# EAGLE board zx80 SD_12 (smd) build006.6 (STM32) (EAGLE 9.6.2), part 1 of 2
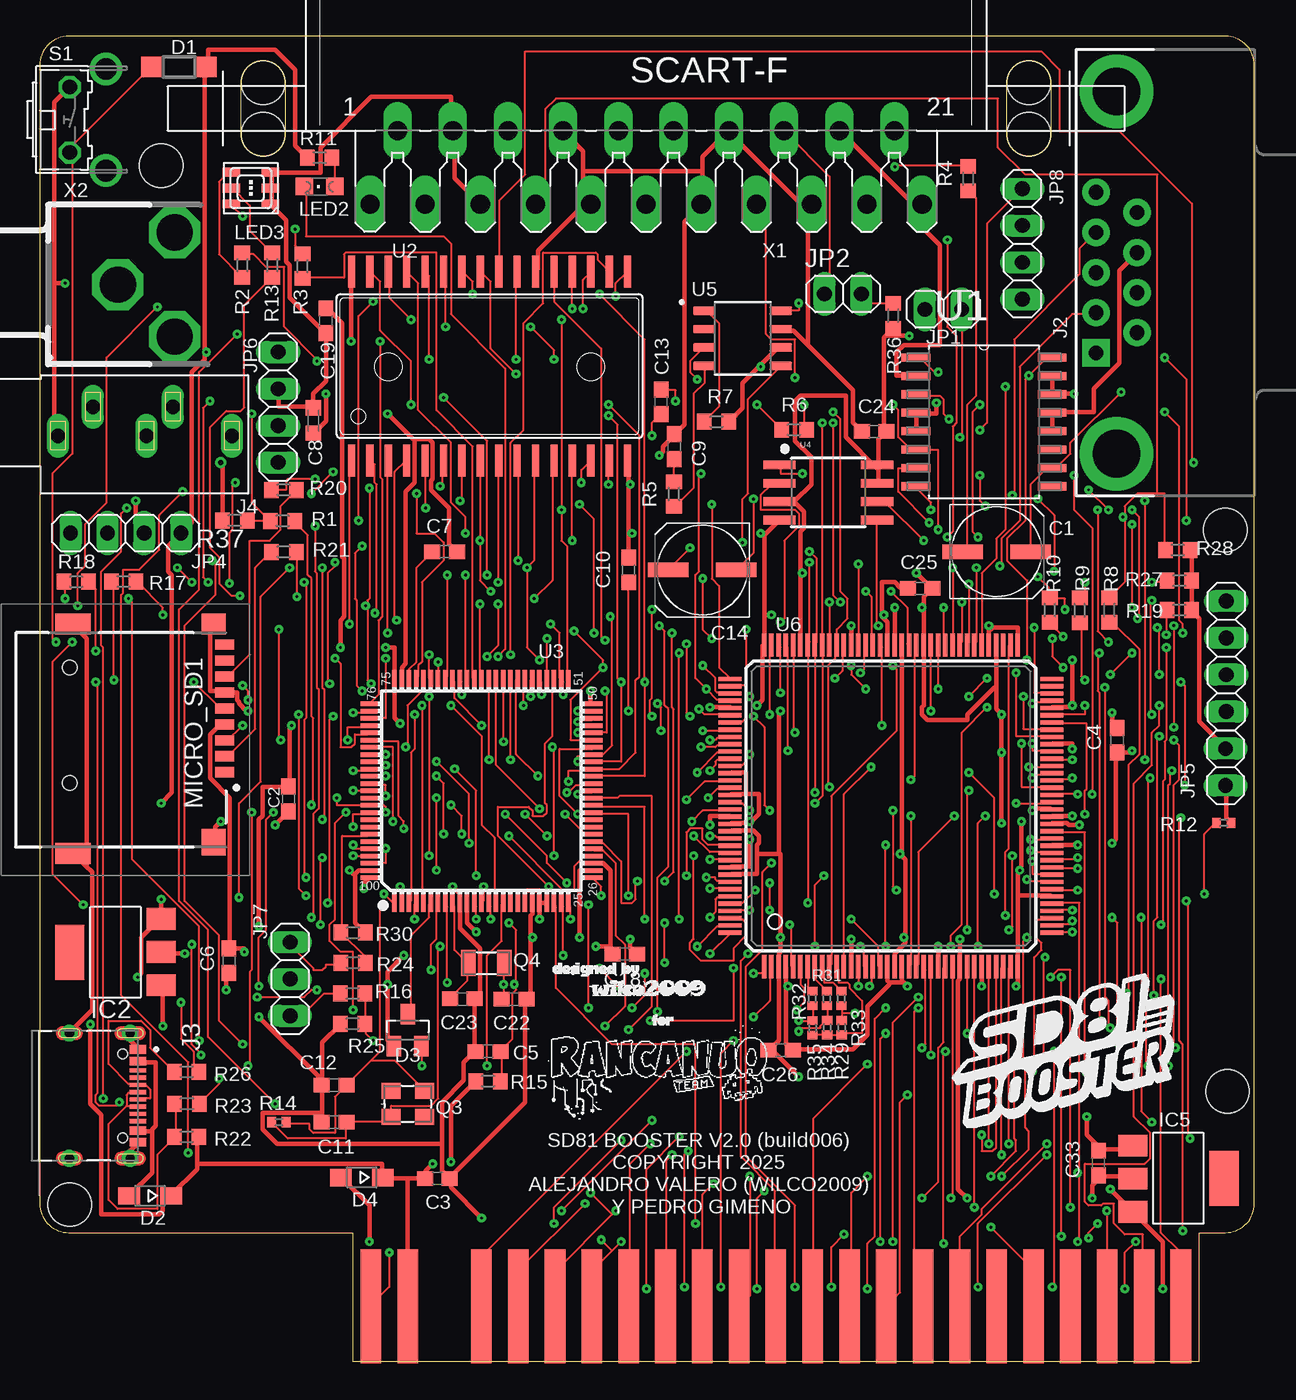
[diagram p3: board, top side]
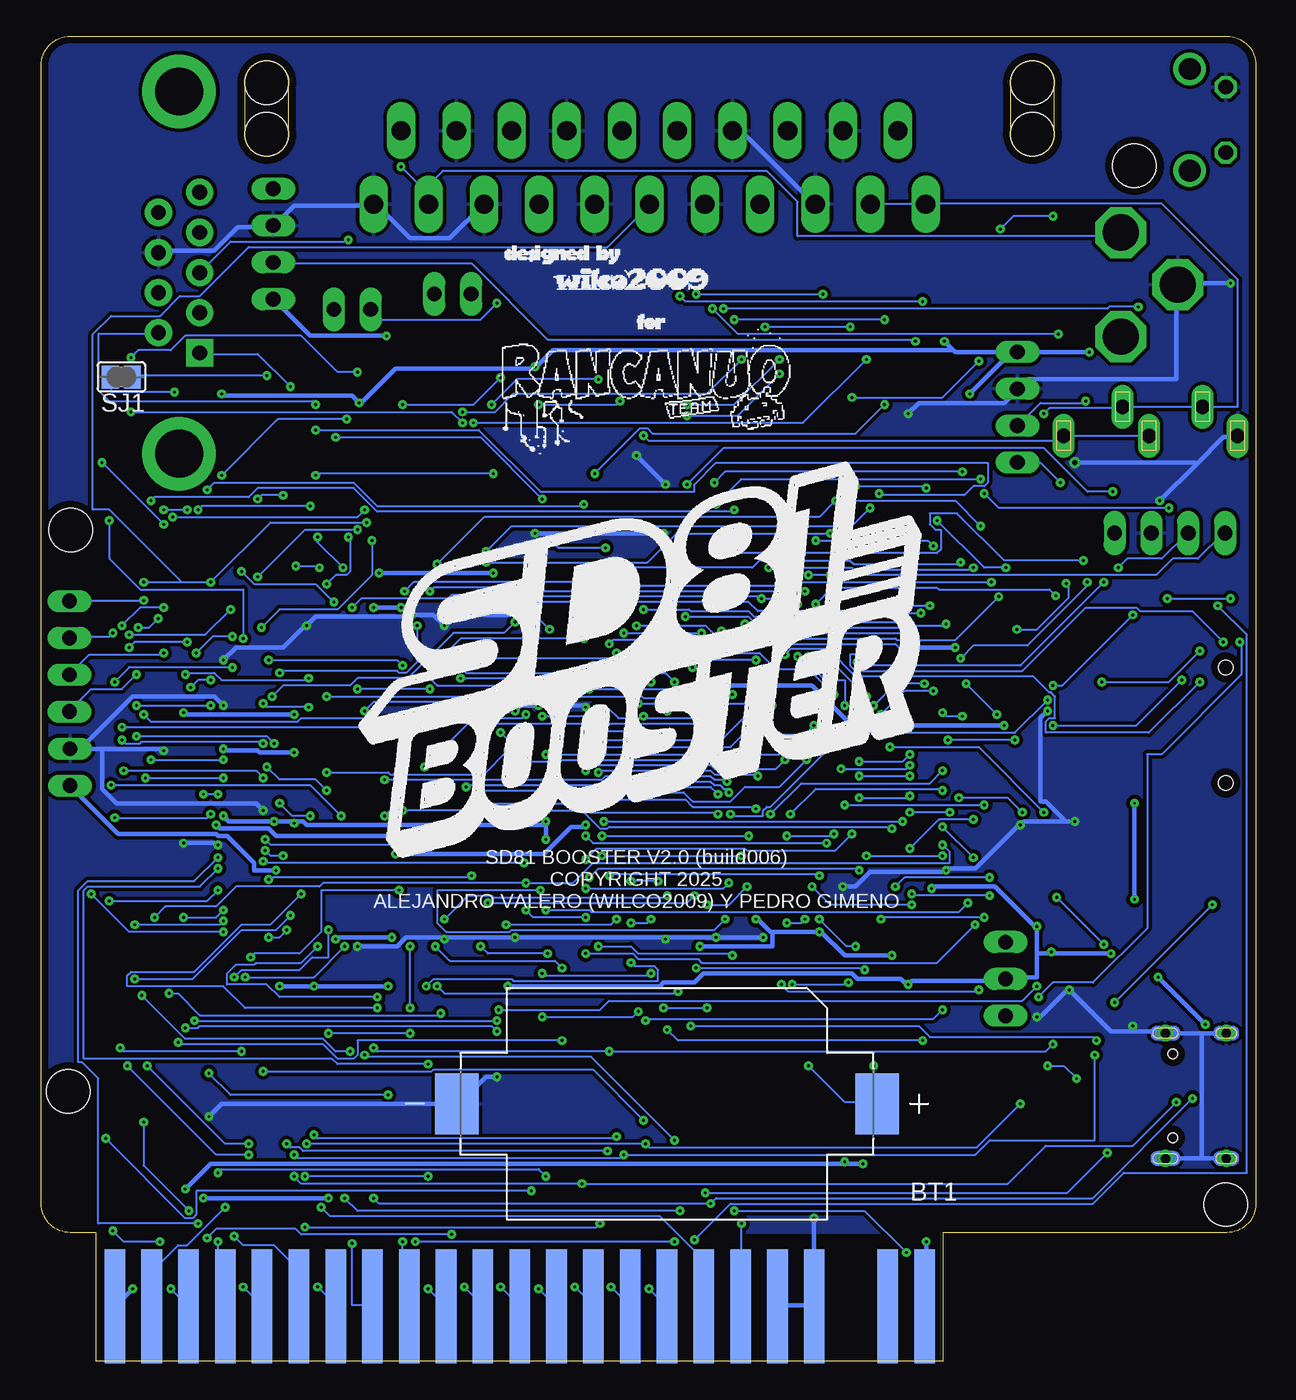
[diagram p4: board, bottom side, seen from below]

Size 83.82 x 91.44 mm. Coordinates in mm from the lower left corner, seen from the top.
Outline: 80.01,8.89 81.82,8.89 arc90 83.82,10.89 83.82,89.44 arc90 81.82,91.44 2,91.44 arc90 0,89.44 0,10.89 arc90 2,8.89 21.59,8.89 21.59,0 80.01,0 80.01,8.89
Copper layers (1*16): Top 0.035mm / dielectric 1.5mm / Bottom 0.035mm
Design rules "default *": minimum track width 5mil, minimum drill 0.2mm, track to track 5mil, track to pad 5mil, pad to pad 5mil, via to via 5mil, smd to smd 5mil, copper to edge 20mil, drill to drill 6mil, minimum pad ring 10mil, minimum via ring 8mil, stop-mask expansion 4mil, vias tented up to drill 999mil, thermal gap 10mil
Net classes: 1 VCC: width 0.3 mm; 2 3,3: width 0.3 mm
Holes 3 mm at 2.09,10.82 8.38,82.51 81.79,57.36 81.96,18.64

## Footprints (pad centres in the part's own frame; a part is rotated, then mirrored left to right if it is on the bottom)
EDGEPIN = smd 1.422 x 7.874: 1 0,0
BAT_CR2032-BS-6-1 = smd 3 x 4.2: N 14.5,0; P -14.5,0
UD-6,3X7,7_NICHICON = smd 2.8 x 1: + 2.35,0; - -2.35,0
C0603 = smd 1.1 x 1: 1 -0.85,0; 2 0.85,0
C0603K = smd 1.05 x 1.08: 1 -0.875,0; 2 0.875,0
SOD123 = smd 1.4 x 1.4: A 1.9,0; C -1.9,0
SOD323-W = smd 1.5 x 1.2: A 1.45,0; C -1.45,0
SOT23 = smd 1 x 1.4: 1 -0.95,-1.1; 2 0.95,-1.1; 3 0,1.1
SOT223 = smd 1.499 x 2.007: 1 -2.261,-3.15; 2 0.025,-3.15; 3 2.311,-3.15 | smd 3.81 x 2.007: 4 0,3.15
DB9_MALE = drill 1.016 pad 1.88 square: 1 5.54,-1.42 | drill 1.016 pad 1.88: 2 2.77,-1.42; 3 0,-1.42; 4 -2.77,-1.42; 5 -5.54,-1.42; 6 4.15,1.42; 7 1.38,1.42; 8 -1.38,1.42; 9 -4.15,1.42 | drill 3.302 pad 5.08: G1 -12.5,0; G2 12.5,0
SHOUHAN_TYPE-C_16PIN_2MD__073_ = smd 0.6 x 1.14: A1_B12 -3.2,3.675; A4_B9 -2.4,3.675; B1_A12 3.2,3.675; B4_A9 2.4,3.675 | smd 0.3 x 1.14: A5 -1.25,3.675; A6 -0.25,3.675; A7 0.25,3.675; A8 1.25,3.675; B5 1.75,3.675; B6 0.75,3.675; B7 -0.75,3.675; B8 -1.75,3.675 | drill 0.65 pad 0.95: SH1 -4.325,3.125; SH2 4.325,3.125; SH3 -4.325,-1.075; SH4 4.325,-1.075 | hole 0.65: -2.89,2.605; 2.89,2.605
XKB_PJ-325C5-G = drill 1 long: 1 0,-0.9; 2 2.4,1.1; 3 7.92,1.1; 4 12,-0.9; 5 6.1,-0.9
1X02 = drill 1.016 long: 1 -1.27,0; 2 1.27,0
1X04 = drill 1.016 long: 1 -3.81,0; 2 -1.27,0; 3 1.27,0; 4 3.81,0
1X03 = drill 1.016 long: 1 -2.54,0; 2 0,0; 3 2.54,0
CHIPLED_0805 = smd 1.2 x 1.2: A 0,-1.05; C 0,1.05
3535-PLCC6 = smd 1.2 x 0.6: P1 1.35,-1.1; P2 1.35,0; P3 1.35,1.1; P4 -1.35,1.1; P5 -1.35,0; P6 -1.35,-1.1
TF-01A = smd 0.7 x 1.3: 1 2.23,7.174; 2 1.13,7.174; 3 0.03,7.174; 4 -1.07,7.174; 5 -2.17,7.174; 6 -3.27,7.174; 7 -4.37,7.174; 8 -5.47,7.174; CD1 -6.57,7.174 | smd 1.448 x 1.651: MP1 -7.989,6.4 | smd 1.448 x 2.438: MP2 -7.989,-3.3; MP3 7.836,-3.3 | smd 1.854 x 1.651: MP4 7.061,6.4 | hole 1: -5.004,-3.531; 2.972,-3.531
3.2X2.5_KX-7 = smd 1.3 x 1.1: 1 -1.15,-0.9; 2 1.15,-0.9; 3 1.15,0.9; 4 -1.15,0.9
3.2X1.5 = smd 1 x 1.8: 1 -1.25,0; 2 1.25,0
R0603 = smd 1 x 1.1: 1 -0.85,0; 2 0.85,0
R0402 = smd 0.6 x 0.7: 1 -0.5,0; 2 0.5,0
B3F-31XX = drill 1.016 octagon: 1 -2.261,-1.245; 2 2.261,-1.245 | drill 1.499 pad 2.159: 3 -3.505,1.245; 4 3.505,1.245
SJ = smd 1.168 x 1.6: 1 -0.762,0; 2 0.762,0
SOIC127P1032X265-16N = smd 1.981 x 0.559: 1 -4.699,4.445; 2 -4.699,3.175; 3 -4.699,1.905; 4 -4.699,0.635; 5 -4.699,-0.635; 6 -4.699,-1.905; 7 -4.699,-3.175; 8 -4.699,-4.445; 9 4.699,-4.445; 10 4.699,-3.175; 11 4.699,-1.905; 12 4.699,-0.635; 13 4.699,0.635; 14 4.699,1.905; 15 4.699,3.175; 16 4.699,4.445
SOP32-5 = smd 2.2 x 0.5: 1 -6.516,9.525; 2 -6.516,8.255; 3 -6.516,6.985; 4 -6.516,5.715; 5 -6.516,4.445; 6 -6.516,3.175; 7 -6.516,1.905; 8 -6.516,0.635; 9 -6.516,-0.635; 10 -6.516,-1.905; 11 -6.516,-3.175; 12 -6.516,-4.445; 13 -6.516,-5.715; 14 -6.516,-6.985; 15 -6.516,-8.255; 16 -6.516,-9.525; 17 6.516,-9.525; 18 6.516,-8.255; 19 6.516,-6.985; 20 6.516,-5.715; 21 6.516,-4.445; 22 6.516,-3.175; 23 6.516,-1.905; 24 6.516,-0.635; 25 6.516,0.635; 26 6.516,1.905; 27 6.516,3.175; 28 6.516,4.445; 29 6.516,5.715; 30 6.516,6.985; 31 6.516,8.255; 32 6.516,9.525
LQFP100-0.5-13.8X13.8MM = smd 1.2 x 0.32: 1 -7.75,6; 2 -7.75,5.5; 3 -7.75,5; 4 -7.75,4.5; 5 -7.75,4; 6 -7.75,3.5; 7 -7.75,3; 8 -7.75,2.5; 9 -7.75,2; 10 -7.75,1.5; 11 -7.75,1; 12 -7.75,0.5; 13 -7.75,0; 14 -7.75,-0.5; 15 -7.75,-1; 16 -7.75,-1.5; 17 -7.75,-2; 18 -7.75,-2.5; 19 -7.75,-3; 20 -7.75,-3.5; 21 -7.75,-4; 22 -7.75,-4.5; 23 -7.75,-5; 24 -7.75,-5.5; 25 -7.75,-6; 51 7.75,-6; 52 7.75,-5.5; 53 7.75,-5; 54 7.75,-4.5; 55 7.75,-4; 56 7.75,-3.5; 57 7.75,-3; 58 7.75,-2.5; 59 7.75,-2; 60 7.75,-1.5; 61 7.75,-1; 62 7.75,-0.5; 63 7.75,0; 64 7.75,0.5; 65 7.75,1; 66 7.75,1.5; 67 7.75,2; 68 7.75,2.5; 69 7.75,3; 70 7.75,3.5; 71 7.75,4; 72 7.75,4.5; 73 7.75,5; 74 7.75,5.5; 75 7.75,6 | smd 0.32 x 1.2: 26 -6,-7.75; 27 -5.5,-7.75; 28 -5,-7.75; 29 -4.5,-7.75; 30 -4,-7.75; 31 -3.5,-7.75; 32 -3,-7.75; 33 -2.5,-7.75; 34 -2,-7.75; 35 -1.5,-7.75; 36 -1,-7.75; 37 -0.5,-7.75; 38 0,-7.75; 39 0.5,-7.75; 40 1,-7.75; 41 1.5,-7.75; 42 2,-7.75; 43 2.5,-7.75; 44 3,-7.75; 45 3.5,-7.75; 46 4,-7.75; 47 4.5,-7.75; 48 5,-7.75; 49 5.5,-7.75; 50 6,-7.75; 76 6,7.75; 77 5.5,7.75; 78 5,7.75; 79 4.5,7.75; 80 4,7.75; 81 3.5,7.75; 82 3,7.75; 83 2.5,7.75; 84 2,7.75; 85 1.5,7.75; 86 1,7.75; 87 0.5,7.75; 88 0,7.75; 89 -0.5,7.75; 90 -1,7.75; 91 -1.5,7.75; 92 -2,7.75; 93 -2.5,7.75; 94 -3,7.75; 95 -3.5,7.75; 96 -4,7.75; 97 -4.5,7.75; 98 -5,7.75; 99 -5.5,7.75; 100 -6,7.75
SO08-EIAJ = smd 0.61 x 2.21: 1 -1.905,-3.378; 2 -0.635,-3.378; 3 0.635,-3.378; 4 1.905,-3.378; 5 1.905,3.353; 6 0.635,3.353; 7 -0.635,3.353; 8 -1.905,3.353
SOIC127P600X170-8N = smd 1.58 x 0.59: 1 -2.625,1.905; 2 -2.625,0.635; 3 -2.625,-0.635; 4 -2.625,-1.905; 5 2.625,-1.905; 6 2.625,-0.635; 7 2.625,0.635; 8 2.625,1.905
TQ144 = smd 1.6 x 0.3: P1 -11.1,8.75; P2 -11.1,8.25; P3 -11.1,7.75; P4 -11.1,7.25; P5 -11.1,6.75; P6 -11.1,6.25; P7 -11.1,5.75; P8 -11.1,5.25; P9 -11.1,4.75; P10 -11.1,4.25; P11 -11.1,3.75; P12 -11.1,3.25; P13 -11.1,2.75; P14 -11.1,2.25; P15 -11.1,1.75; P16 -11.1,1.25; P17 -11.1,0.75; P18 -11.1,0.25; P19 -11.1,-0.25; P20 -11.1,-0.75; P21 -11.1,-1.25; P22 -11.1,-1.75; P23 -11.1,-2.25; P24 -11.1,-2.75; P25 -11.1,-3.25; P26 -11.1,-3.75; P27 -11.1,-4.25; P28 -11.1,-4.75; P29 -11.1,-5.25; P30 -11.1,-5.75; P31 -11.1,-6.25; P32 -11.1,-6.75; P33 -11.1,-7.25; P34 -11.1,-7.75; P35 -11.1,-8.25; P36 -11.1,-8.75; P73 11.1,-8.75; P74 11.1,-8.25; P75 11.1,-7.75; P76 11.1,-7.25; P77 11.1,-6.75; P78 11.1,-6.25; P79 11.1,-5.75; P80 11.1,-5.25; P81 11.1,-4.75; P82 11.1,-4.25; P83 11.1,-3.75; P84 11.1,-3.25; P85 11.1,-2.75; P86 11.1,-2.25; P87 11.1,-1.75; P88 11.1,-1.25; P89 11.1,-0.75; P90 11.1,-0.25; P91 11.1,0.25; P92 11.1,0.75; P93 11.1,1.25; P94 11.1,1.75; P95 11.1,2.25; P96 11.1,2.75; P97 11.1,3.25; P98 11.1,3.75; P99 11.1,4.25; P100 11.1,4.75; P101 11.1,5.25; P102 11.1,5.75; P103 11.1,6.25; P104 11.1,6.75; P105 11.1,7.25; P106 11.1,7.75; P107 11.1,8.25; P108 11.1,8.75 | smd 0.3 x 1.6: P37 -8.75,-11.1; P38 -8.25,-11.1; P39 -7.75,-11.1; P40 -7.25,-11.1; P41 -6.75,-11.1; P42 -6.25,-11.1; P43 -5.75,-11.1; P44 -5.25,-11.1; P45 -4.75,-11.1; P46 -4.25,-11.1; P47 -3.75,-11.1; P48 -3.25,-11.1; P49 -2.75,-11.1; P50 -2.25,-11.1; P51 -1.75,-11.1; P52 -1.25,-11.1; P53 -0.75,-11.1; P54 -0.25,-11.1; P55 0.25,-11.1; P56 0.75,-11.1; P57 1.25,-11.1; P58 1.75,-11.1; P59 2.25,-11.1; P60 2.75,-11.1; P61 3.25,-11.1; P62 3.75,-11.1; P63 4.25,-11.1; P64 4.75,-11.1; P65 5.25,-11.1; P66 5.75,-11.1; P67 6.25,-11.1; P68 6.75,-11.1; P69 7.25,-11.1; P70 7.75,-11.1; P71 8.25,-11.1; P72 8.75,-11.1; P109 8.75,11.1; P110 8.25,11.1; P111 7.75,11.1; P112 7.25,11.1; P113 6.75,11.1; P114 6.25,11.1; P115 5.75,11.1; P116 5.25,11.1; P117 4.75,11.1; P118 4.25,11.1; P119 3.75,11.1; P120 3.25,11.1; P121 2.75,11.1; P122 2.25,11.1; P123 1.75,11.1; P124 1.25,11.1; P125 0.75,11.1; P126 0.25,11.1; P127 -0.25,11.1; P128 -0.75,11.1; P129 -1.25,11.1; P130 -1.75,11.1; P131 -2.25,11.1; P132 -2.75,11.1; P133 -3.25,11.1; P134 -3.75,11.1; P135 -4.25,11.1; P136 -4.75,11.1; P137 -5.25,11.1; P138 -5.75,11.1; P139 -6.25,11.1; P140 -6.75,11.1; P141 -7.25,11.1; P142 -7.75,11.1; P143 -8.25,11.1; P144 -8.75,11.1
SCART-F = drill 1.321 long: 1 19.05,5.08; 2 17.145,0; 3 15.24,5.08; 4 13.335,0; 5 11.43,5.08; 6 9.525,0; 7 7.62,5.08; 8 5.715,0; 9 3.81,5.08; 10 1.905,0; 11 0,5.08; 12 -1.905,0; 13 -3.81,5.08; 14 -5.715,0; 15 -7.62,5.08; 16 -9.525,0; 17 -11.43,5.08; 18 -13.335,0; 19 -15.24,5.08; 20 -17.145,0; 21 -19.05,5.08 | hole 3.023: 26.416,0.254; 26.416,-3.302; -26.416,0.254; -26.416,-3.302
3P = drill 2.5 pad 3.302 octagon: 1 -0.11,0; 2 3.81,3.595; 2@2 3.81,-3.595

## Placement (x,y rotation side)
1A  D7  [EDGEPIN]  22.86,3.81 0 top
1B  VCC  [EDGEPIN]  22.86,3.81 180 bottom
2A  /RAMCS  [EDGEPIN]  25.4,3.81 0 top
2B  9V  [EDGEPIN]  25.4,3.81 180 bottom
4A  D0  [EDGEPIN]  30.48,3.81 0 top
4B  GND  [EDGEPIN]  30.48,3.81 180 bottom
5A  D1  [EDGEPIN]  33.02,3.81 0 top
5B  GND  [EDGEPIN]  33.02,3.81 180 bottom
6A  D2  [EDGEPIN]  35.56,3.81 0 top
6B  /CLOCK  [EDGEPIN]  35.56,3.81 180 bottom
7A  D6  [EDGEPIN]  38.1,3.81 0 top
7B  A0  [EDGEPIN]  38.1,3.81 180 bottom
8A  D5  [EDGEPIN]  40.64,3.81 0 top
8B  A1  [EDGEPIN]  40.64,3.81 180 bottom
9A  D3  [EDGEPIN]  43.18,3.81 0 top
9B  A2  [EDGEPIN]  43.18,3.81 180 bottom
10A  D4  [EDGEPIN]  45.72,3.81 0 top
10B  A3  [EDGEPIN]  45.72,3.81 180 bottom
11A  A6  [EDGEPIN]  48.26,3.81 0 top
11B  A15  [EDGEPIN]  48.26,3.81 180 bottom
12A  /NMI  [EDGEPIN]  50.8,3.81 0 top
12B  A14  [EDGEPIN]  50.8,3.81 180 bottom
13A  /HALT  [EDGEPIN]  53.34,3.81 0 top
13B  A13  [EDGEPIN]  53.34,3.81 180 bottom
14A  /MREQ  [EDGEPIN]  55.88,3.81 0 top
14B  A12  [EDGEPIN]  55.88,3.81 180 bottom
15A  /IORQ  [EDGEPIN]  58.42,3.81 0 top
15B  A11  [EDGEPIN]  58.42,3.81 180 bottom
16A  /RD  [EDGEPIN]  60.96,3.81 0 top
16B  A10  [EDGEPIN]  60.96,3.81 180 bottom
17A  /WR  [EDGEPIN]  63.5,3.81 0 top
17B  A9  [EDGEPIN]  63.5,3.81 180 bottom
18A  /BUSAK  [EDGEPIN]  66.04,3.81 0 top
18B  A8  [EDGEPIN]  66.04,3.81 180 bottom
19A  /WAIT  [EDGEPIN]  68.58,3.81 0 top
19B  A7  [EDGEPIN]  68.58,3.81 180 bottom
20A  /BUSRQ  [EDGEPIN]  71.12,3.81 0 top
20B  A6  [EDGEPIN]  71.12,3.81 180 bottom
21A  /RESET  [EDGEPIN]  73.66,3.81 0 top
21B  A5  [EDGEPIN]  73.66,3.81 180 bottom
22A  /M1  [EDGEPIN]  76.2,3.81 0 top
22B  A4  [EDGEPIN]  76.2,3.81 180 bottom
23A  /RFSH  [EDGEPIN]  78.74,3.81 0 top
23B  /ROMCS  [EDGEPIN]  78.74,3.81 180 bottom
BT1  CR2032-BS-6-1  [BAT_CR2032-BS-6-1]  40.64,17.78 180 bottom
C1  220uF  [UD-6,3X7,7_NICHICON]  66.04,55.88 0 top
C2  100nF  [C0603]  17.17,38.81 270 top
C3  10uF  [C0603]  27.45,12.63 0 top
C4  100nF  [C0603]  74.34,42.86 90 top
C5  22pF  [C0603]  30.94,21.39 0 top
C6  10uF  [C0603]  13.07,27.66 270 top
C7  10uF  [C0603]  27.94,55.88 0 top
C8  100nF  [C0603K]  18.88,64.92 270 top
C9  1uF  [C0603]  43.78,63.12 270 top
C10  10uF  [C0603]  40.64,54.61 90 top
C11  22pF  [C0603]  20.32,16.51 0 top
C12  22pF  [C0603]  20.32,19.05 0 top
C13  1uF  [C0603]  42.87,66.22 90 top
C14  470uF  [UD-6,3X7,7_NICHICON]  45.72,54.61 180 top
C18  100nF  [C0603]  40.37,28.11 0 top
C19  100nF  [C0603]  19.75,71.81 270 top
C22  22pF  [C0603]  32.73,25 180 top
C23  22pF  [C0603]  29.16,25.02 180 top
C24  0.1uF  [C0603]  57.58,64.17 180 top
C25  0.1uF  [C0603]  60.76,53.34 180 top
C26  100nF  [C0603]  51.13,21.49 180 top
C33  10uF  [C0603]  73.05,13.7 90 top
D1  1n4148  [SOD123]  9.62,89.32 180 top
D2  1n5819  [SOD323-W]  7.62,11.43 180 top
D3  BAT54C  [SOT23]  25.4,22.86 0 top
D4  1n5819  [SOD323-W]  22.23,12.7 180 top
IC2  REG1117  [SOT223]  5.23,28.23 90 top
IC5  1.2V  [SOT223]  78.57,12.64 270 top
J2  JOYSTICK  [DB9_MALE]  74.31,75.13 270 top
J3  TYPE-C_16PIN_2MD__073_  [SHOUHAN_TYPE-C_16PIN_2MD__073_]  3.12,18.33 270 top
J4  PJ-325C5-G  [XKB_PJ-325C5-G]  1.27,64.77 0 top
JP1  SPEAKER  [1X02]  62.35,72.6 0 top
JP2  [1X02]  55.43,73.67 0 top
JP3  JTAG  [1X04]  81.88,48.65 90 top
JP4  SERIAL  [1X04]  5.94,57.16 180 top
JP5  VREF  [1X02]  81.83,41.01 90 top
JP6  PS2  [1X04]  16.46,65.84 270 top
JP7  BOOT  [1X03]  17.28,26.39 270 top
JP8  ST-LINK-V2  [1X04]  67.81,77.11 270 top
LED2  SD  [CHIPLED_0805]  19.33,81.06 90 top
LED3  STATUS  [3535-PLCC6]  14.57,80.96 0 top
MICRO_SD1  TF-01A  [TF-01A]  5.6,42.89 270 top
Q3  8MHz  [3.2X2.5_KX-7]  25.4,17.78 0 top
Q4  32767Hz  [3.2X1.5]  30.82,27.49 0 top
R1  300R  [R0603]  16.75,58 0 top
R2  150  [R0603]  13.98,75.64 270 top
R3  68  [R0603]  18.13,75.59 90 top
R4  75R  [R0603]  64.07,81.62 270 top
R5  100R  [R0603]  43.76,59.86 90 top
R6  100R  [R0603]  52.06,64.28 180 top
R7  10K  [R0603]  46.71,64.84 0 top
R8  270  [R0603]  73.8,51.86 270 top
R9  270  [R0603]  71.76,51.83 270 top
R10  270  [R0603]  69.69,51.85 270 top
R11  680  [R0603]  19.31,83.06 0 top
R12  2K  [R0402]  81.71,37.16 180 top
R13  150  [R0603]  16.05,75.63 90 top
R14  1M  [R0402]  16.51,16.51 0 top
R15  3k3  [R0603]  30.94,19.34 180 top
R16  510  [R0603]  21.59,25.4 0 top
R17  3k3  [R0603]  5.79,53.81 180 top
R18  3k3  [R0603]  2.52,53.8 0 top
R19  75R  [R0603]  78.63,51.84 0 top
R20  3k3  [R0603]  16.85,60.14 0 top
R21  3k3  [R0603]  16.85,55.86 180 top
R22  1K5  [R0603]  10.14,15.5 0 top
R23  22R  [R0603]  10.16,17.78 0 top
R24  510  [R0603]  21.63,27.51 180 top
R25  10K  [R0603]  21.6,23.3 0 top
R26  22R  [R0603]  10.13,19.98 0 top
R27  75R  [R0603]  78.63,53.88 0 top
R28  75R  [R0603]  78.54,55.98 0 top
R29  1K  [R0402]  55.32,25.04 270 top
R30  10K  [R0603]  21.63,29.59 180 top
R31  1K  [R0402]  54.32,25.04 270 top
R32  1K  [R0402]  53.32,25.04 270 top
R33  2K  [R0402]  55.34,23.03 90 top
R34  2K  [R0402]  54.34,23.03 90 top
R35  2K  [R0402]  53.33,23.01 90 top
R36  100R  [R0603]  58.89,72.15 270 top
R37  100R  [R0603]  13.47,58.03 180 top
S1  RESET  [B3F-31XX]  3.32,85.67 270 top
SJ1  [SJ]  78.28,67.92 180 bottom
U1  AD724  [SOIC127P1032X265-16N]  65.16,64.83 0 top
U2  AS6C4008  [SOP32-5]  31.04,68.68 90 top
U3  MCU-STM32F407VET6(LQFP100)  [LQFP100-0.5-13.8X13.8MM]  30.48,39.37 90 top
U4  W25Q128JVSIQ  [SO08-EIAJ]  54.44,59.96 270 top
U5  PAM8302  [SOIC127P600X170-8N]  48.5,70.59 0 top
U6  XC6SLX9-2TQG144C  [TQ144]  58.74,38.34 90 top
X1  SCART-F  [SCART-F]  41.84,84.93 180 top
X2  CON-CONRAD_736880-2P  [3P]  5.51,74.3 0 top

## Tracks (layer width: path | path; a pad name or v marks a point on that pad's centre or on a via)
1V2  (via drill 0.2)
  Top 0.3: IC5.2 75.38,12.64 75.38,12.77 73.12,12.77 C33.1 73.12,12.64 72.62,12.14 v72.62,11.27 | v46.25,37.02 46.25,37.64 47.62,37.64 U6.P128 | 59.75,29.27 59.75,28.89 59,28.14 59,27.27 U6.P19 | 59.75,29.27 59.75,34.64 v59.38,35.02 59.5,35.02 59.5,49.39 U6.P89 | v63.5,29.14 63.5,27.27 U6.P28 63.5,27.14 63.5,26.39 63.38,26.27 63.38,11.89 v64,11.27 | v59.62,29.27 59.75,29.27 | v71.75,37.02 71,37.02 70.88,37.14 69.88,37.14 U6.P52
  Bottom 0.3: v46.25,37.02 46.38,36.89 47.25,36.89 49.12,35.02 57,35.02 | v59.38,35.02 57,35.02 | v63.5,29.14 63.38,29.27 v59.62,29.27 | v71.75,37.02 71.5,36.77 68.12,36.77 67.62,36.27 58.12,36.27 57,35.14 57,35.02 | v64,11.27 v72.62,11.27
3V3  (via drill 0.2)
  Top 0.3: v20.75,49.27 20.75,51.14 21,51.39 21,55.39 20.88,55.52 20.88,71.64 19.88,72.64 C19.1 | v23.88,49.27 24.5,49.27 24.5,47.14 U3.75 24.5,47.02 24.5,44.39 v24.88,44.02 | v38,46.27 38,45.52 38.12,45.39 U3.50 | v30.12,29.64 29.5,30.27 29.5,31.52 U3.11 | v34.5,30.52 34.5,31.52 U3.21 | U3.19 33.5,31.64 33.5,32.39 33.62,32.52 34.5,32.52 34.5,31.77 U3.21 | U3.22 34.88,31.64 34.62,31.64 U3.21 | 39.38,28.64 39.38,33.89 38.88,34.39 38.25,34.39 U3.28 | 39.38,28.64 39.38,28.27 39.5,28.14 C18.1 | 39.38,28.64 v38.38,28.64 | MICRO_SD1.4 12.75,43.89 12.38,43.89 11.75,43.27 11.75,40.27 13.12,38.89 13.12,28.52 C6.1 13.25,28.52 14.12,28.52 v14.12,28.27 | v15.12,30.02 15.12,37.39 15.38,37.64 15.38,39.64 17.12,39.64 C2.1 17.25,39.77 17.25,43.77 v17.38,43.89 | U3.100 22.38,33.02 v22.38,32.64 | D3.1 24.38,21.77 24,22.14 v24,26.02 24,26.89 v25.12,28.02 | v10,28.14 8.5,28.14 IC2.2 | 58.62,26.14 58.5,26.27 58.5,27.14 U6.P18 | 59.5,26.14 58.62,26.14 | 59.5,26.14 59.5,27.14 U6.P20 | 51.5,25.89 51.5,27.14 U6.P4 | 51.5,25.89 51.5,21.89 51.88,21.52 C26.1 52.12,21.52 56.12,21.52 57.12,22.52 57.12,24.52 58.62,26.02 58.62,26.14 | R12.1 82.12,37.27 81.88,37.52 81.88,39.64 JP5.1 | v65,25.89 65,27.14 U6.P31 | v67.38,25.89 67.5,26.02 67.5,27.14 U6.P36 67.5,27.39 67.5,32.14 | 67.5,32.14 69.75,32.14 U6.P42 | 67.5,32.14 67.5,33.77 v67.62,33.89 67.62,34.02 67.75,34.14 v67.75,37.27 | v59.88,25.89 59.62,26.14 59.5,26.14 | 52.5,54.39 52.5,57.27 52.75,57.52 52.75,58.64 52.12,59.27 51.12,59.27 U4.3 52.12,59.39 53.25,60.52 53.25,62.39 52.12,63.52 52.12,66.27 52.5,66.64 55.62,66.64 55.62,63.77 57.75,61.64 U4.8
  Top 0.3: 52.5,54.39 52.5,49.52 U6.P103 | U4.8 57.88,61.89 57.88,63.64 58.38,64.14 C24.1 58.25,64.14 58.25,70.64 58.44,70.83 | 58.44,70.83 58.88,71.27 R36.2 | U4.7 57.88,60.64 57.88,61.77 U4.8 | v60,70.77 58.5,70.77 58.44,70.83 | 61,52.02 61,49.52 U6.P86 61,49.39 61,45.27 60.88,45.14 60.88,44.64 61.25,44.27 64,44.27 64,44.64 65.88,46.52 66,46.52 | 61,52.02 61,52.77 61.5,53.27 C25.1 61.5,53.39 v60.5,54.39 | v59,52.02 59,49.52 U6.P90 | v60.88,52.02 61,52.02 | v74,44.77 74,44.02 74.25,43.77 C4.2 | 66,46.52 66,49.39 U6.P76 | 66,46.52 66,45.02 v66.38,44.64 v66.38,42.02 v66.38,37.14 | v71.25,42.27 71.25,42.64 69.88,42.64 U6.P63 | v49,36.02 49,34.14 47.75,34.14 U6.P135 | U6.P129 47.75,37.14 48.62,37.14 48.75,37.27 v49,37.27 49.12,37.27 49.62,37.77 49.62,39.14 48.75,39.14 | v71.25,37.64 69.88,37.64 U6.P53 | 48.75,39.14 47.75,39.14 U6.P125 | 48.75,39.14 48.75,40.64 47.75,40.64 U6.P122 | v52.62,54.39 52.5,54.39 | v51.62,25.89 51.5,25.89
  Bottom 0.3: v23.88,49.27 v20.75,49.27 | v38,46.27 37.62,46.64 30.62,46.64 28,44.02 v24.88,44.02 24.75,44.02 24.62,43.89 v17.38,43.89 | 33.38,29.64 33.5,29.64 34.38,30.52 v34.5,30.52 | 33.38,29.64 v30.12,29.64 30,29.64 28.38,28.02 v25.12,28.02 | 33.38,29.64 33.38,28.64 v38.38,28.64 | 15.12,28.14 15.12,26.52 17.12,26.52 17.25,26.39 JP7.2 17.38,26.27 23.75,26.27 v24,26.02 24.12,26.02 24.5,26.39 27.5,26.39 27.88,26.77 38.12,26.77 38.75,26.14 40.88,26.14 41.12,25.89 v51.62,25.89 | 15.12,28.14 v15.12,30.02 15.25,30.02 18,32.77 22.25,32.77 v22.38,32.64 | 15.12,28.14 14.12,28.14 | 14.12,28.14 v10,28.14 | v14.12,28.27 14.12,28.14 | v67.38,25.89 v65,25.89 v59.88,25.89 | v67.62,33.89 69.12,33.89 69.12,34.39 71,36.27 71.62,36.27 71.75,36.39 78.5,36.39 81.75,39.64 JP5.1 | v60,70.77 65.25,70.77 67.75,73.27 JP8.4 | v60.88,52.02 v59,52.02 | v74,44.77 73.88,44.64 v66.38,44.64 | v71.25,42.27 71.12,42.14 68.88,42.14 68.75,42.02 v66.38,42.02 | v49,36.02 v49,37.27 49.12,37.02 65.5,37.02 65.75,37.27 66.38,37.27 | v71.25,37.64 70.88,37.27 v67.75,37.27 66.38,37.27 | v66.38,37.14 66.38,37.27 | v60.5,54.39 v52.62,54.39
/CLOCK  (via drill 0.2)
  Top 0.127: v61.5,21.14 61.5,27.14 U6.P24 | v40.12,15.27 35.5,10.64 v35.5,9.52
  Bottom 0.127: v61.5,21.14 61.38,21.02 45.88,21.02 v40.12,15.27 | v35.5,9.52 35.5,3.89 6B.1
/HALT  (via drill 0.2)
  Top 0.127: v71.62,34.02 69.88,34.02 U6.P46 | v57.12,20.52 53.38,16.77 53.38,3.89 13A.1
  Bottom 0.127: v71.62,34.02 72.88,32.77 80.62,32.77 80.88,32.52 80.88,20.89 63.75,20.89 63.38,20.52 v57.12,20.52
/IORQ  (via drill 0.2)
  Top 0.127: v72.25,19.89 72.12,20.02 72.12,36.52 69.88,36.52 U6.P51 | v59.88,18.39 59.38,17.89 59.38,4.77 15A.1
  Bottom 0.127: v72.25,19.89 70.75,18.39 v59.88,18.39
/M1  (via drill 0.2)
  Top 0.127: v72.12,45.27 72.12,44.64 69.88,44.64 U6.P67 | v77.25,45.27 77.25,43.89 76.75,43.39 76.75,41.14 75.5,39.89 75.5,16.89 76.62,15.77 76.62,14.02 76.25,13.64 72.12,13.64 72.12,11.02 72.38,10.77 73.25,10.77 73.38,10.89 74.12,10.89 74.12,9.52 74.88,8.77 76.12,8.77 76.12,3.89 22A.1
  Bottom 0.127: v77.25,45.27 v72.12,45.27
/MEM_OE  (via drill 0.2)
  Top 0.127: v58.12,43.89 58.12,49.27 58,49.39 U6.P92 | v78.25,50.77 v78.25,43.77 | v75.38,57.77 v75.38,52.02 | v79.62,62.02 79.5,62.14 79.5,79.89 74.5,84.89 70.38,84.89 70.38,89.14 69.12,90.39 33.5,90.39 33.5,81.89 31.75,80.14 31.75,75.27 U2.24
  Bottom 0.127: v58.12,43.89 58.25,43.77 v78.25,43.77 | v78.25,50.77 77,52.02 v75.38,52.02 | v79.62,62.02 v75.38,57.77
/MREQ  (via drill 0.2)
  Top 0.127: v68.38,35.27 68.38,35.14 69.75,35.14 U6.P48 | v67.12,34.89 67.12,30.02 v66.88,29.77 | v68.12,29.27 67.88,29.02 67.88,20.89 67.25,20.27 67.25,15.39 67.38,15.27 67.38,14.52 v65.62,12.77 | v57.12,12.77 56,11.64 56,3.89 14A.1
  Bottom 0.127: v68.38,35.27 68,34.89 v67.12,34.89 | v66.88,29.77 67.38,29.27 v68.12,29.27 | v57.12,12.77 v65.62,12.77
/NMI  (via drill 0.2)
  Top 0.127: v68.12,33.27 68.12,33.14 69.75,33.14 U6.P44 | v54.12,33.52 53.5,32.89 v53.5,28.64 | v48.88,28.14 48.38,27.64 48.38,14.14 50.75,11.77 50.75,3.89 12A.1
  Bottom 0.127: v68.12,33.27 68,33.39 54.25,33.39 v54.12,33.52 | v53.5,28.64 53,28.14 v48.88,28.14
/OE_OL  (via drill 0.2)
  Top 0.127: v37.12,43.39 37.5,43.77 38.12,43.77 U3.47 | v57.38,41.02 55.5,39.14 55.5,27.27 U6.P12
  Bottom 0.127: v37.12,43.39 37.75,44.02 54.38,44.02 v57.38,41.02
/RD  (via drill 0.2)
  Top 0.127: v51.62,42.14 51.62,49.27 51.5,49.39 U6.P105 | v64.12,40.64 65.88,38.89 v65.88,32.27 | v60.62,24.39 60.38,24.14 60.38,4.39 60.88,3.89 16A.1
  Bottom 0.127: v51.62,42.14 53.25,40.52 59.75,40.52 59.88,40.64 v64.12,40.64 | v65.88,32.27 68,30.14 70,30.14 73.25,26.89 77.62,26.89 77.88,26.64 77.88,25.89 71.25,25.89 69.75,24.39 v60.62,24.39
/RESET  (via drill 0.2)
  Top 0.127: v21.62,35.64 21.62,35.39 22.62,35.39 U3.96 | v50.38,31.14 v50.38,33.02 | v46.25,30.64 46.62,31.02 46.62,31.89 46.75,32.02 47.62,32.02 U6.P139 | v73.62,10.39 73.62,3.89 21A.1 | v76.75,16.52 76,17.27 v76,30.64
  Bottom 0.127: v21.62,35.64 21.12,35.14 21.12,34.39 45.75,34.39 47.12,33.02 v50.38,33.02 64.38,33.02 64.62,32.77 70.38,32.77 71.75,31.39 75.25,31.39 v76,30.64 | v50.38,31.14 49.88,30.64 v46.25,30.64 | v73.62,10.39 76.75,13.52 v76.75,16.52
/RFSH  (via drill 0.2)
  Top 0.127: v66.62,30.77 66.62,35.14 66.88,35.39 66.88,49.39 U6.P74 | v77.38,26.39 77.38,8.89 78.62,7.64 78.62,3.89 23A.1
  Bottom 0.127: v66.62,30.77 67.62,29.77 70,29.77 73.38,26.39 v77.38,26.39
/WAIT  (via drill 0.2)
  Top 0.127: v45.25,9.52 45.25,21.89 39.5,21.89 35.62,25.77 35.62,31.39 35.5,31.52 U3.23 | v65.62,9.27 68.5,6.39 68.5,3.89 19A.1
  Bottom 0.127: v45.25,9.52 45.5,9.27 v65.62,9.27
/WR  (via drill 0.2)
  Top 0.127: v71.25,40.27 71.25,40.14 69.88,40.14 U6.P58 | v76.62,40.27 76.5,40.14 76.5,25.64 76.38,25.52 76.38,20.52 v76.5,20.39 | v69.5,15.02 65,10.52 65,10.14 63.5,8.64 17A.1
  Bottom 0.127: v76.62,40.27 v71.25,40.27 | v76.5,20.39 71.12,15.02 v69.5,15.02
/WR'  (via drill 0.2)
  Top 0.127: v38.75,32.14 38.75,32.77 38.25,33.27 U3.26 | v53,31.64 53,49.39 U6.P102 53,49.52 53.12,49.64 v53.12,55.14 | v29.38,57.14 29.38,58.27 28.38,59.27 28.38,63.39 26.12,65.64 26.12,74.39 25.38,75.14 U2.29
  Bottom 0.127: v38.75,32.14 39.25,31.64 v53,31.64 | v29.38,57.14 40,57.14 42,55.14 v53.12,55.14
A0  (via drill 0.2)
  Top 0.127: v64.5,10.64 64.5,27.14 U6.P30
  Bottom 0.127: v64.5,10.64 63.88,10.02 41.12,10.02 38.12,7.02 38.12,3.89 7B.1
A0'  (via drill 0.2)
  Top 0.127: v21.62,34.89 22.62,34.89 U3.97 | v26.88,45.89 v26.88,34.89 | v30.88,48.64 31.62,49.39 v31.62,52.27 | v34.12,52.64 35.38,53.89 35.38,62.14 U2.12 | v62.38,52.02 62.38,49.52 U6.P83
  Bottom 0.127: v26.88,34.89 v21.62,34.89 | v26.88,45.89 29.62,48.64 v30.88,48.64 | v31.62,52.27 32,52.64 v34.12,52.64 34.25,52.77 52.5,52.77 52.62,52.89 55.5,52.89 55.75,52.64 61.75,52.64 v62.38,52.02
A1  (via drill 0.2)
  Top 0.127: v65,15.64 65,14.52 65.75,14.52 66,14.77 66,27.14 U6.P33 | v44.12,15.52 41.88,13.27 v41.88,5.02
  Bottom 0.127: v65,15.64 64.75,15.39 44.25,15.39 v44.12,15.52 | v41.88,5.02 40.75,3.89 8B.1
A1'  (via drill 0.2)
  Top 0.127: v23.88,35.39 23.88,34.39 22.75,34.39 U3.98 | v19.5,37.39 19.62,37.52 19.62,46.39 19.5,46.52 v19.5,54.77 | U2.11 34.12,62.14 34.12,55.27 v33.62,54.77 33.62,49.27 v34.5,48.39 | v62,46.39 62,49.39 U6.P84 | v57,46.39 56,47.39 v56,48.02
  Bottom 0.127: v23.88,35.39 21.88,37.39 v19.5,37.39 | v19.5,54.77 19.62,54.64 27.75,54.64 27.88,54.77 v33.62,54.77 | v57,46.39 v62,46.39 | v56,48.02 55.5,48.52 44.5,48.52 44.38,48.39 v34.5,48.39
A2  (via drill 0.2)
  Top 0.127: v66.88,15.02 66.88,27.14 U6.P35 | v44.75,14.52 44.5,14.27 v44.5,5.14
  Bottom 0.127: v66.88,15.02 66.62,14.77 66,14.77 65.75,14.52 v44.75,14.52 | v44.5,5.14 43.25,3.89 9B.1
A2'  (via drill 0.2)
  Top 0.127: v23.75,32.27 24.38,31.64 U3.1 | v18.38,32.14 17.88,32.64 v17.88,44.64 | v20,46.77 19.88,46.89 19.88,54.39 20.38,54.89 v20.38,55.14 | v33,55.27 33,62.14 U2.10 | v61.5,44.89 61.5,49.39 U6.P85 | v46.38,49.89 45.75,50.52 v45.75,54.02
  Bottom 0.127: v23.75,32.27 23.62,32.14 v18.38,32.14 | v20,46.77 v17.88,44.64 | v20.38,55.14 20.5,55.02 27.75,55.02 28,55.27 v33,55.27 34.25,55.27 34.75,54.77 45,54.77 v45.75,54.02 | v61.5,44.89 60.88,45.52 51,45.52 50.62,45.89 50.62,46.64 56.5,46.64 57.12,47.27 57.12,48.14 56.62,48.14 54.88,49.89 v46.38,49.89
A3  (via drill 0.2)
  Top 0.127: v71.25,31.14 69.88,31.14 U6.P40 | v74,30.64 74.38,30.27 v74.38,22.02 | v47.88,22.14 47,21.27 v47,5.14
  Bottom 0.127: v71.25,31.14 71.75,30.64 v74,30.64 | v74.38,22.02 74.25,21.89 64.38,21.89 63.38,20.89 62.25,20.89 62,21.14 62,22.14 v47.88,22.14 | v47,5.14 45.75,3.89 10B.1
A3'  (via drill 0.2)
  Top 0.127: v24.88,32.77 24.88,31.64 U3.2 | v18.38,33.39 18.25,33.52 18.25,44.27 18.38,44.39 18.38,53.64 v18.25,53.77 | v31.62,53.77 31.62,62.14 U2.9 | v58.75,53.14 59.88,52.02 59.88,49.52 U6.P88
  Bottom 0.127: v24.88,32.77 24.25,33.39 v18.38,33.39 | v18.25,53.77 v31.62,53.77 31.88,53.52 46,53.52 46.25,53.77 58.12,53.77 v58.75,53.14
A4  (via drill 0.2)
  Top 0.127: v68.5,45.39 68.5,45.52 69.75,45.52 U6.P69 | v65.38,45.14 63.62,43.39 63.62,30.14 62.88,29.39 v62.88,28.64 | v69.75,26.52 70.25,27.02 71.12,27.02 v71.12,10.64
  Bottom 0.127: v68.5,45.39 68.25,45.14 v65.38,45.14 | v62.88,28.64 65,26.52 v69.75,26.52 | v71.12,10.64 73.75,8.02 74.38,8.02 76.12,6.27 76.12,3.89 22B.1
A4'  (via drill 0.2)
  Top 0.127: U3.3 25.62,31.77 25.62,42.02 25.88,42.27 v25.88,44.64 | v22.25,46.27 21.88,46.64 21.88,52.52 21.75,52.64 21.75,55.77 v22.25,56.27 | U2.8 30.38,62.14 v30.38,56.64 30.38,53.89 v31.12,53.14 | v57,53.14 57.38,52.77 57.38,49.52 U6.P93
  Bottom 0.127: v25.88,44.64 24.25,46.27 v22.25,46.27 | v22.25,56.27 22.62,56.64 v30.38,56.64 | v57,53.14 56.75,53.39 52.75,53.39 52.5,53.14 v31.12,53.14
A5  (via drill 0.2)
  Top 0.127: v72.12,37.77 72.12,39.39 72.25,39.52 72.25,44.02 69.88,44.02 U6.P66 | v78.75,37.52 78.62,37.39 78.62,22.14 78.88,21.89 v78.88,9.02 | v75.62,8.27 74.88,7.52 v74.88,5.02
  Bottom 0.127: v72.12,37.77 72.38,37.52 v78.75,37.52 | v78.88,9.02 78.12,8.27 v75.62,8.27 | v74.88,5.02 73.75,3.89 21B.1
A5'  (via drill 0.2)
  Top 0.127: v25.88,30.52 25.88,31.52 U3.4 | v18.75,30.64 18.88,30.77 18.88,37.77 19.25,38.14 19.25,46.39 19.12,46.52 19.12,54.39 19,54.52 v19,57.64 | v29,59.39 29.12,59.52 29.12,62.14 U2.7 | v56.5,55.02 56.5,49.52 U6.P95
  Bottom 0.127: v25.88,30.52 25.75,30.64 v18.75,30.64 | v19,57.64 20.75,59.39 v29,59.39 30.12,58.27 53.25,58.27 v56.5,55.02
A6  (via drill 0.2)
  Top 0.127: 71.75,13.02 71.75,8.39 v71.62,8.27 | 71.75,13.02 71.75,31.64 69.88,31.64 U6.P41 | v49,12.77 49,4.52 48.38,3.89 11A.1 | 71.75,13.02 v71.62,13.02
  Bottom 0.127: v71.62,8.27 71.62,3.89 71.12,3.89 20B.1 | v49,12.77 49.5,13.27 71.38,13.27 v71.62,13.02
A6'  (via drill 0.2)
  Top 0.127: v26.38,45.27 26.38,31.64 U3.5 | v22.88,46.77 22.62,47.02 22.62,52.14 | 22.62,52.14 22.62,52.52 22.75,52.64 v22.75,60.27 | v27.62,60.39 27.75,60.52 27.75,62.14 U2.6 | v54.5,52.39 54.5,49.52 U6.P99 | 22.62,52.14 v22.5,52.14
  Bottom 0.127: v26.38,45.27 24.88,46.77 v22.88,46.77 | v22.75,60.27 22.88,60.39 v27.62,60.39 | v54.5,52.39 35,52.39 34.38,51.77 25.12,51.77 24.75,52.14 v22.5,52.14
A7  (via drill 0.2)
  Top 0.127: v68.5,42.64 68.5,42.14 69.75,42.14 U6.P62 | v78.25,42.89 78.62,42.52 78.62,40.14 78.25,39.77 78.25,21.77 v78.38,21.64 | v70,21.39 70,5.27 v69.88,5.14
  Bottom 0.127: v68.5,42.64 68.62,42.77 76.88,42.77 77,42.64 78,42.64 v78.25,42.89 | v78.38,21.64 78.12,21.39 v70,21.39 | v69.88,5.14 68.62,3.89 19B.1
A7'  (via drill 0.2)
  Top 0.127: v37.12,39.14 37.12,39.27 38.12,39.27 U3.38 | v53.5,39.27 53.5,49.39 U6.P101 53.5,49.52 53.62,49.64 53.62,55.39 v53.12,55.89 | v26.62,58.89 26.62,62.14 U2.5
  Bottom 0.127: v37.12,39.14 37.62,39.64 44.88,39.64 45.12,39.39 53.38,39.39 v53.5,39.27 | v26.62,58.89 27.88,57.64 51.38,57.64 v53.12,55.89
A8  (via drill 0.2)
  Top 0.127: v68.25,41.02 69.75,41.02 U6.P60 | v64.12,39.39 64,39.27 v64,29.77 | v70.5,8.64 v70.5,26.52
  Bottom 0.127: v68.25,41.02 67.38,40.14 64.88,40.14 v64.12,39.39 | v64,29.77 64,27.89 65.12,27.89 66,27.02 70,27.02 v70.5,26.52 | v70.5,8.64 69.88,8.02 67.75,8.02 66.12,6.39 66.12,3.89 18B.1
A8'  (via drill 0.2)
  Top 0.127: v36.38,39.27 36.5,39.27 37,39.77 38.12,39.77 U3.39 | v54.5,39.64 54.38,39.77 54.38,48.02 54.88,48.52 54.88,49.39 U6.P98 55,49.52 55,50.52 55.75,51.27 55.75,52.64 55.25,53.14 55.25,65.02 v54.75,65.52 | v28,71.39 28,75.02 27.88,75.14 U2.27 | v33.88,71.39 35.5,69.77 v35.5,69.14
  Bottom 0.127: v36.38,39.27 36.62,39.52 36.75,39.52 37,39.77 37.38,39.77 37.62,40.02 44.88,40.02 45.12,39.77 54.38,39.77 v54.5,39.64 | v33.88,71.39 v28,71.39 | v35.5,69.14 37.88,66.77 51.25,66.77 52.5,65.52 v54.75,65.52
A9  (via drill 0.2)
  Top 0.127: v68.5,40.27 68.5,40.52 69.75,40.52 U6.P59 | v78.12,40.77 78,40.64 78,39.89 77.88,39.77 v77.88,20.39 | v69.5,14.27 64.75,9.52 v64.75,5.14
  Bottom 0.127: v68.5,40.27 69,40.77 v78.12,40.77 | v77.88,20.39 71.75,14.27 v69.5,14.27 | v64.75,5.14 63.5,3.89 17B.1
A9'  (via drill 0.2)
  Top 0.127: v54.88,47.14 55.38,47.64 55.38,49.39 U6.P97 | U3.40 38.25,40.39 41.75,40.39 v41.75,46.89 41.75,70.52 v38.62,73.64 | v29.88,73.64 29.88,74.52 29.25,75.14 U2.26
  Bottom 0.127: v41.75,46.89 42,47.14 v54.88,47.14 | v38.62,73.64 v29.88,73.64
A10  (via drill 0.2)
  Top 0.127: v67.75,42.64 67.75,39.64 69.75,39.64 U6.P57 | v77.25,43.14 77.12,43.02 77.12,30.64 76.88,30.39 v76.88,25.27 | v62.5,21.39 62.38,21.27 v62.38,8.14
  Bottom 0.127: v67.75,42.64 68.25,43.14 v77.25,43.14 | v76.88,25.27 73.88,22.27 64.38,22.27 63.5,21.39 v62.5,21.39 | v62.38,8.14 62.38,3.89 61,3.89 16B.1
A10'  (via drill 0.2)
  Top 0.127: v36.5,40.02 36.5,40.77 38.12,40.77 U3.41 38.25,40.89 40,40.89 41.12,42.02 41.12,47.02 41.38,47.27 41.38,63.89 v39.25,66.02 | v60.12,40.14 60.38,40.39 60.38,49.39 U6.P87 | v32.88,69.14 32.88,75.14 U2.23
  Bottom 0.127: v36.5,40.02 36.62,40.14 37.38,40.14 37.62,40.39 44.88,40.39 45.12,40.14 v60.12,40.14 | v32.88,69.14 36,66.02 v39.25,66.02
A11  (via drill 0.2)
  Top 0.127: v67.38,38.52 69.75,38.52 U6.P55 | v65.25,37.64 64.75,37.14 v64.75,28.64 | v60.62,25.14 58.88,23.39 v58.88,8.27
  Bottom 0.127: v67.38,38.52 66.5,37.64 v65.25,37.64 | v64.75,28.64 65.88,27.52 69,27.52 69.12,27.39 70.38,27.39 71,26.77 71,26.02 68.25,26.02 67.38,25.14 v60.62,25.14 | v58.88,8.27 58.88,3.89 58.5,3.89 15B.1
A11'  (via drill 0.2)
  Top 0.127: v56.62,47.52 56.88,47.77 56.88,49.39 U6.P94 | U3.42 38.25,41.39 40.12,41.39 v40.12,46.89 39.88,47.14 39.88,64.64 v39.25,65.27 | v32.88,68.14 31.12,69.89 31.12,74.52 30.5,75.14 U2.25
  Bottom 0.127: v40.12,46.89 40.75,47.52 54.5,47.52 54.62,47.64 55.62,47.64 55.75,47.52 v56.62,47.52 | v32.88,68.14 35.75,65.27 v39.25,65.27
A12  (via drill 0.2)
  Top 0.127: v68.38,36.02 69.75,36.02 U6.P50 | v58.38,28.64 v58.38,35.64 | v58.38,24.39 57.62,23.64 57.62,8.64 57.12,8.14 v57.12,5.02
  Bottom 0.127: v68.38,36.02 68,35.64 v58.38,35.64 | v58.38,24.39 v58.38,28.64 | v57.12,5.02 56,3.89 14B.1
A12'  (via drill 0.2)
  Top 0.127: v37.12,41.39 37.12,41.77 38.12,41.77 U3.43 38.25,41.89 38.88,41.89 39.5,42.52 39.5,51.27 v39.38,51.39 | v52.12,43.39 52,43.52 52,49.39 U6.P104 | v24.62,51.14 24.5,51.27 24.5,61.39 25.25,62.14 U2.4
  Bottom 0.127: v37.12,41.39 37.25,41.52 48.62,41.52 48.75,41.39 50.12,41.39 v52.12,43.39 | v24.62,51.14 24.75,51.02 34.62,51.02 35,51.39 v39.38,51.39
A13  (via drill 0.2)
  Top 0.127: v71.62,34.77 71.62,34.64 69.88,34.64 U6.P47 | v73,9.52 72.38,8.89 v72.38,8.52 | v55.5,8.77 54.62,7.89 v54.62,5.14
  Bottom 0.127: v71.62,34.77 73.25,33.14 80.62,33.14 81.25,32.52 81.25,20.64 81,20.64 79.88,19.52 79.88,9.52 v73,9.52 | v72.38,8.52 71.75,9.14 66.25,9.14 65.88,8.77 v55.5,8.77 | v54.62,5.14 53.38,3.89 13B.1
A13'  (via drill 0.2)
  Top 0.127: v37.12,37.77 35.88,39.02 35.88,42.27 38.12,42.27 U3.44 | v53.5,38.52 54,39.02 54,49.39 U6.P100 54,49.52 v54,64.77 | v26.88,69.14 26.88,74.89 26.62,75.14 U2.28
  Bottom 0.127: v37.12,37.77 37.25,37.89 46,37.89 46.62,38.52 v53.5,38.52 | v26.88,69.14 31.25,64.77 v54,64.77
A14  (via drill 0.2)
  Top 0.127: v68.5,34.52 68.5,33.64 69.75,33.64 U6.P45 | v50.5,34.39 49.88,33.77 49.88,28.39 48.75,27.27 48.75,14.14 52.12,10.77 v52.12,5.14
  Bottom 0.127: v68.5,34.52 68.38,34.39 v50.5,34.39 | v52.12,5.14 50.88,3.89 12B.1
A14'  (via drill 0.2)
  Top 0.127: v45.75,48.02 46.62,47.14 46.62,46.27 46.75,46.14 47.62,46.14 U6.P111 | U3.45 38.12,42.89 36.62,42.89 36.62,45.64 v38.88,47.89 38.88,48.39 v36.88,50.39 | v24,50.27 24,62.14 U2.3
  Bottom 0.127: v38.88,47.89 39,48.02 v45.75,48.02 | v24,50.27 34.62,50.27 34.75,50.39 v36.88,50.39
A15  (via drill 0.2)
  Top 0.127: v71.62,32.52 69.88,32.52 U6.P43 | v79.12,31.77 79.25,31.64 79.25,15.52 v79.38,15.39 | v50,11.77 49.5,11.27 v49.5,5.02
  Bottom 0.127: v71.62,32.52 72.38,31.77 v79.12,31.77 | v79.38,15.39 73.88,9.89 73.38,9.89 73.12,10.14 73.12,11.77 v50,11.77 | v49.5,5.02 48.38,3.89 11B.1
A15'  (via drill 0.2)
  Top 0.127: v39,46.27 39.12,46.14 39.12,43.39 38.25,43.39 U3.46 | U6.P112 47.62,45.64 46.75,45.64 v46,46.39 45.25,47.14 45.25,54.27 45.5,54.52 45.5,61.14 v45.62,61.27 | v25.62,66.02 25.62,69.02 23.5,71.14 23.5,74.52 22.88,75.14 U2.31
  Bottom 0.127: v39,46.27 39.12,46.39 v46,46.39 | v25.62,66.02 27.62,64.02 41.62,64.02 42,64.39 42.5,64.39 v45.62,61.27
A16'  (via drill 0.2)
  Top 0.127: v37.12,44.14 37.12,44.27 38.12,44.27 U3.48 | v45.5,45.02 45.88,44.64 47.62,44.64 U6.P114 | v23.12,51.64 23.25,51.77 23.25,60.52 23.12,60.64 23.12,61.89 22.88,62.14 U2.2 | v42.25,51.89 42.25,45.77 42.12,45.64 42.12,44.64 v42.25,44.52
  Bottom 0.127: v37.12,44.14 37.38,44.39 42.25,44.39 | 42.25,44.39 44,44.39 44.62,45.02 v45.5,45.02 | v23.12,51.64 24.88,51.64 25.12,51.39 34.62,51.39 35,51.77 39,51.77 39.12,51.89 v42.25,51.89 | 42.25,44.39 v42.25,44.52
A17'  (via drill 0.2)
  Top 0.127: v36,71.89 v36,58.77 36,56.64 36.38,56.27 36.38,47.14 U3.51 | v25.62,71.89 24.12,73.39 24.12,75.14 U2.30 | v71.25,41.52 69.88,41.52 U6.P61 | v76.25,59.39 v76.25,41.52
  Bottom 0.127: v25.62,71.89 v36,71.89 | v76.25,41.52 v71.25,41.52 | v76.25,59.39 76,59.64 69.5,59.64 68.88,60.27 62.25,60.27 60.62,58.64 36.12,58.64 v36,58.77
A18'  (via drill 0.2)
  Top 0.127: v36.12,46.02 36.12,46.89 36,47.02 U3.52 35.88,47.14 35.88,50.27 v35.25,50.89 | v49,45.89 48.75,45.64 48.75,44.39 48.5,44.14 47.75,44.14 U6.P115 | v21.38,50.89 21.38,62.02 21.5,62.14 U2.1
  Bottom 0.127: v36.12,46.02 36.38,45.77 42.25,45.77 42.38,45.89 v49,45.89 | v21.38,50.89 21.5,50.77 24.25,50.77 24.38,50.64 34.62,50.64 34.88,50.89 v35.25,50.89
B0  (via drill 0.2)
  Top 0.127: v34.62,46.02 34.62,46.89 34.5,47.02 U3.55 | v42.62,45.39 42.88,45.14 v42.88,43.52 | v45.75,43.52 47.62,43.52 U6.P116
  Bottom 0.127: v34.62,46.02 35.25,45.39 v42.62,45.39 | v45.75,43.52 v42.88,43.52
B1  (via drill 0.2)
  Top 0.127: v33.88,45.89 33.88,47.02 U3.56 | v46.25,42.89 46.62,42.89 46.75,43.02 47.62,43.02 U6.P117
  Bottom 0.127: v33.88,45.89 36.88,42.89 v46.25,42.89
B2  (via drill 0.2)
  Top 0.127: v33.38,45.27 33.38,47.02 U3.57 | v45.62,42.39 46.62,42.39 46.75,42.52 47.62,42.52 U6.P118
  Bottom 0.127: v33.38,45.27 36.25,42.39 v45.62,42.39
B3  (via drill 0.2)
  Top 0.127: v34.38,40.39 32.88,41.89 32.88,47.02 U3.58 | v45.38,40.64 46.75,42.02 47.62,42.02 U6.P119
  Bottom 0.127: v34.38,40.39 34.5,40.52 37.38,40.52 37.62,40.77 45.25,40.77 v45.38,40.64
B4  (via drill 0.2)
  Top 0.127: v32.5,41.52 32.5,47.02 U3.59 | v46.25,40.77 46.62,41.14 46.62,41.39 46.75,41.52 47.62,41.52 U6.P120
  Bottom 0.127: v32.5,41.52 33.12,40.89 37.38,40.89 37.62,41.14 45.88,41.14 v46.25,40.77
B5  (via drill 0.2)
  Top 0.127: v32,42.77 32,47.02 U3.60 | v49,41.89 48.75,41.64 48.75,41.39 48.5,41.14 47.75,41.14 U6.P121
  Bottom 0.127: v32,42.77 32.88,41.89 v49,41.89
B6  (via drill 0.2)
  Top 0.127: v34.5,38.14 31.5,41.14 31.5,47.02 U3.61 | v44.62,38.77 45.88,40.02 47.62,40.02 U6.P123
  Bottom 0.127: v34.5,38.14 34.62,38.27 38.88,38.27 39.38,38.77 v44.62,38.77
B7  (via drill 0.2)
  Top 0.127: v31,41.52 31,47.02 U3.62 | v46.12,38.89 46.75,39.52 47.62,39.52 U6.P124
  Bottom 0.127: v31,41.52 32.88,39.64 35.25,39.64 36.25,38.64 38.88,38.64 39.5,39.27 44.88,39.27 45.25,38.89 v46.12,38.89
BAT  (via drill 0.2)
  Top 0.127: v30.88,20.39 30.88,28.02 31.88,29.02 31.88,31.52 U3.16 | v26.38,20.39 26.38,21.64 D3.2
  Bottom 0.127: v30.88,20.39 28.38,17.89 26.38,17.89 | 26.38,17.89 26.25,17.89 BT1.P 26.38,17.89 | 26.38,17.89 v26.38,20.39
BOOT0
  Top 0.127: R24.1 22.38,27.52 22.38,28.02 20.88,29.52 R30.2 20.88,29.64 20.88,36.27 22.62,36.27 U3.94
BRIGHT
  Top 0.127: R35.1 53.38,22.52 54.25,22.52 R34.1 54.38,22.52 55.25,22.52 R33.1 55.38,22.64 56.75,22.64 56.75,24.89 55.88,25.77 55.88,26.02 55.75,26.14 55.12,26.14 55.12,27.02 55,27.14 U6.P11
CFG_CLK  (via drill 0.2)
  Top 0.127: v40.62,32.14 40.62,37.77 38.25,37.77 U3.35 | v56,30.52 57.88,28.64 57.88,27.27 U6.P17
  Bottom 0.127: v40.62,32.14 40.75,32.02 52.62,32.02 52.75,32.14 54.38,32.14 v56,30.52
CFG_DATA  (via drill 0.2)
  Top 0.127: v23.88,37.89 23.88,38.27 23.38,38.77 22.75,38.77 U3.89 | v21.12,37.89 20.38,37.14 20.38,30.52 20,30.14 20,29.02 20.75,28.27 21.62,28.27 v21.62,24.27 | v42.12,23.52 47.88,23.52 v47.88,27.14 | v56.62,28.64 56.88,28.39 56.88,27.27 U6.P15
  Bottom 0.127: v21.12,37.89 v23.88,37.89 | v21.62,24.27 22.25,23.64 42,23.64 v42.12,23.52 | v47.88,27.14 48.38,27.64 55.62,27.64 v56.62,28.64
CFG_RESET  (via drill 0.2)
  Top 0.127: v41.75,30.52 41.75,38.27 38.25,38.27 U3.36 | v43.12,27.52 v43.12,30.27 | v57.25,25.89 57.38,26.02 57.38,27.14 U6.P16
  Bottom 0.127: v41.75,30.52 42,30.27 v43.12,30.27 | v43.12,27.52 42.88,27.27 41.5,27.27 41.25,27.02 41.25,26.27 51.25,26.27 51.38,26.39 56.75,26.39 v57.25,25.89
COMPOSITE  (via drill 0.2)
  Top 0.127: R4.1 64,82.52 59,82.52 v59,82.45
  Bottom 0.127: X2.2 9.38,77.89 9.62,77.64 31.62,77.64 31.62,80.02 33.75,82.14 56.12,82.14 57.08,81.19 57.08,80.53 | v59,82.45 57.08,80.53 | 57.08,80.53 57.08,80 X1.19
CS_LLS
  Top 0.127: R21.2 15.88,55.77 14.88,54.77 14.88,43.64 12.88,41.64 MICRO_SD1.2
CSYNC  (via drill 0.2)
  Top 0.127: v58.88,48.02 59.12,47.77 59.12,43.52 54.62,39.02 54.62,27.39 54.5,27.27 U6.P10 | v68.12,48.39 68.12,53.89 66.75,55.27 66.75,56.77 68,58.02 68,67.77 v68.25,68.02 69.5,69.27 69.75,69.27 U1.16
  Bottom 0.127: v58.88,48.02 59.25,48.39 v68.12,48.39 | v68.25,68.02 77.5,68.02 SJ1.1
CTRL_CLK  (via drill 0.2)
  Top 0.127: v20.5,38.89 20.5,38.39 22.62,38.39 U3.90 | v16.12,37.89 15.62,37.39 15.62,29.77 15.12,29.27 v15.12,25.89 | v52.25,24.27 52.75,24.77 52.75,25.77 52.5,26.02 52.5,27.14 U6.P6
  Bottom 0.127: v20.5,38.89 17.12,38.89 v16.12,37.89 | v15.12,25.89 16.12,24.89 44.62,24.89 45.25,24.27 v52.25,24.27
D0  (via drill 0.2)
  Top 0.127: v60.88,21.64 61.12,21.89 61.12,27.02 61,27.14 U6.P23 | v44.62,21.39 30.5,7.27 30.5,3.89 4A.1 | v36.75,56.64 36.75,62.14 U2.13 | v11.91,55.27 12.12,55.05 12.12,52.89 10,50.77 10,31.77 12.38,29.39 12.38,23.52 v14,21.89
  Bottom 0.127: v60.88,21.64 60.62,21.39 v44.62,21.39 14.5,21.39 v14,21.89 | v36.75,56.64 35.88,55.77 22,55.77 21.75,56.02 21.75,57.39 22.12,57.39 22.5,57.77 22.5,58.52 20.62,58.52 17.38,55.27 v11.91,55.27
D1  (via drill 0.2)
  Top 0.127: v60.88,11.27 62,12.39 62,21.64 62.38,22.02 62.38,27.14 U6.P26 | v37.62,10.89 33.12,6.39 33.12,3.89 5A.1 | v37.38,60.64 37.38,61.52 38,62.14 U2.14 | v18.75,59.89 v20.25,61.39 | v6,58.89 5.62,58.52 5.62,55.89 4.25,54.52 4.25,49.39 4.38,49.27 v4.38,18.14
  Bottom 0.127: v60.88,11.27 60.5,10.89 v37.62,10.89 37.25,11.27 11.25,11.27 v4.38,18.14 | v37.38,60.64 36.62,61.39 v20.25,61.39 | v18.75,59.89 17.75,58.89 v6,58.89
D2  (via drill 0.2)
  Top 0.127: v62.88,11.27 63,11.39 63,27.14 U6.P27 | 39.5,10.14 35.62,6.27 35.62,3.89 6A.1 | 39.5,10.14 v39.75,10.39 | v39.25,60.52 39.25,62.14 U2.15 | v9.88,60.02 8.25,58.39 8.25,56.02 6.88,54.64 5.75,54.64 5.75,53.02 5.62,52.89 5.62,25.27 10.25,20.64 v10.25,14.39 | 39.5,10.14 v38,11.64
  Bottom 0.127: v62.88,11.27 62,10.39 v39.75,10.39 | v39.25,60.52 36.75,63.02 14.62,63.02 11.62,60.02 v9.88,60.02 | v10.25,14.39 13,11.64 v38,11.64
D3  (via drill 0.2)
  Top 0.127: v66.38,14.27 66.38,27.14 U6.P34 | v43.62,14.27 43.25,13.89 43.25,3.89 9A.1 | v39.75,73.52 39.75,74.39 40.5,75.14 U2.17 | v23,73.14 22,72.14 v22,58.02 | v17.25,54.77 15.25,52.77 15.25,40.02 13.75,38.52 v13.75,32.02 | v10.5,28.77 10.5,21.89 11.12,21.27 v11.12,21.14
  Bottom 0.127: v66.38,14.27 66.12,14.02 43.88,14.02 v43.62,14.27 19.38,14.27 18.38,15.27 11.12,15.27 v11.12,21.14 | v39.75,73.52 39.38,73.14 v23,73.14 | v22,58.02 18.75,54.77 v17.25,54.77 | v10.5,28.77 v13.75,32.02
D4  (via drill 0.2)
  Top 0.127: v66.38,12.77 68.25,14.64 68.25,15.89 68,16.14 68,20.27 68.62,20.89 68.62,27.89 69.12,28.39 69.12,28.89 68.75,29.27 68.75,30.52 69.75,30.52 U6.P39 | v46.5,12.27 45.75,11.52 45.75,3.89 10A.1 | v32.5,48.77 32.5,63.39 33.38,64.27 33.38,71.64 34.75,73.02 34.75,76.52 38.38,76.52 38.5,76.39 38.5,76.02 39.25,75.27 U2.18 | v3.88,46.89 4,46.77 4,18.52 3.88,18.39 3.88,17.89 4.12,17.64 5.5,17.64 v5.5,17.89
  Bottom 0.127: v66.38,12.77 65.88,12.27 v46.5,12.27 17.12,12.27 14.5,14.89 8.5,14.89 v5.5,17.89 | v32.5,48.77 32.12,49.14 29.5,49.14 27.62,47.27 15.38,47.27 14.25,46.14 14.12,46.14 13.88,45.89 13.88,44.39 14.25,44.39 14.5,44.14 14.5,43.39 7.38,43.39 v3.88,46.89
D5  (via drill 0.2)
  Top 0.127: v65.5,15.02 65.5,27.14 U6.P32 | v42.12,15.02 40.75,13.64 40.75,3.89 8A.1 | v37.5,72.64 37.5,74.64 38,75.14 U2.19 | v13.62,70.89 11,68.27 11,53.27 9.62,51.89 9.62,31.77 11.62,29.77 11.62,22.39 v16.25,17.77
  Bottom 0.127: v65.5,15.02 v42.12,15.02 41.88,14.77 19.25,14.77 v16.25,17.77 | v37.5,72.64 35.75,70.89 v13.62,70.89
D6  (via drill 0.2)
  Top 0.127: v64,22.64 64,27.14 U6.P29 | v58.38,22.64 58,22.27 v58,8.27 | 39.5,7.64 38.12,6.27 38.12,3.89 7A.1 | 39.5,7.64 v40.12,8.27 | v36.75,72.64 36.75,75.14 U2.20 | v8.12,72.77 4.62,69.27 4.62,59.27 3.12,57.77 3.12,54.89 2.62,54.39 v2.62,52.14 | 39.5,7.64 v38.75,8.39
  Bottom 0.127: v58.38,22.64 v64,22.64 | v40.12,8.27 v58,8.27 | v36.75,72.64 10.25,72.64 10.12,72.77 v8.12,72.77 | v2.62,52.14 0.62,50.14 0.62,13.02 9.12,13.02 11.25,10.89 36.25,10.89 v38.75,8.39
D7  (via drill 0.2)
  Top 0.127: v60.12,37.64 60.12,27.39 60,27.27 U6.P21 | v50.38,38.02 50,38.39 50,43.77 v49.25,44.52 | v44.88,44.52 44.62,44.77 v44.62,49.52 | v39,49.77 38.75,50.02 38.75,69.89 35.5,73.14 35.5,75.14 U2.21 | v24.12,7.52 24.12,5.14 22.88,3.89 1A.1 | v42.25,16.64 v36,10.39 | v68.5,20.02 69.25,20.77 69.25,27.77 v69.38,27.89 | v59.12,32.52 58.88,32.77 v58.88,38.02
  Bottom 0.127: v60.12,37.64 59.75,38.02 v58.88,38.02 v50.38,38.02 | v44.88,44.52 v49.25,44.52 | v44.62,49.52 44.38,49.77 v39,49.77 | v24.12,7.52 27,10.39 v36,10.39 | v42.25,16.64 45.75,20.14 56.75,20.14 56.88,20.02 v68.5,20.02 | v69.38,27.89 69.12,28.14 66,28.14 64.5,29.64 64.5,32.52 v59.12,32.52
DI_LLS  (via drill 0.2)
  Top 0.127: v5.12,47.02 5.12,53.64 5,53.77 R17.2 | v14,43.89 12.88,42.77 MICRO_SD1.3
  Bottom 0.127: v5.12,47.02 8.25,43.89 v14,43.89
DOWN  (via drill 0.2)
  Top 0.127: v64.62,54.77 64.62,49.64 64.5,49.52 U6.P79 | v66.25,54.89 66.38,55.02 66.38,56.77 67.62,58.02 67.62,68.64 71.25,72.27 72.88,72.27 J2.2
  Bottom 0.127: v64.62,54.77 64.75,54.89 v66.25,54.89
EN_M1_NOT  (via drill 0.2)
  Top 0.127: v36.62,30.52 36.62,31.39 36.5,31.52 U3.25 | v49.38,32.52 48.5,31.64 47.75,31.64 U6.P140
  Bottom 0.127: v36.62,30.52 37.38,29.77 51.38,29.77 51.5,29.64 55.88,29.64 56.5,30.27 56.5,32.52 v49.38,32.52
FIRE  (via drill 0.2)
  Top 0.127: v63,54.77 63,49.52 U6.P82 | v64.75,56.89 64.38,57.27 64.38,65.52 v64.88,66.02
  Bottom 0.127: v63,54.77 64.75,56.52 v64.75,56.89 | v64.88,66.02 65.12,66.27 79.12,66.27 79.88,67.02 79.88,70.89 75.75,70.89 J2.6
FLASH_CS  (via drill 0.2)
  Top 0.127: v71.25,30.39 71.25,30.14 69.88,30.14 U6.P38 | v77.38,30.14 77.5,30.27 77.5,40.02 77.62,40.14 77.62,42.77 77.75,42.89 v77.75,49.27 | v73.75,49.64 73,50.39 v73,58.77 | v65.25,59.02 64.88,59.39 v64.88,61.14 | v52.62,61.27 51.12,61.27 51.12,61.77 U4.1
  Bottom 0.127: v71.25,30.39 71.5,30.14 v77.38,30.14 | v77.75,49.27 77.38,49.64 v73.75,49.64 | v73,58.77 72.75,59.02 v65.25,59.02 | v64.88,61.14 64.75,61.27 v52.62,61.27
FLASH_MISO  (via drill 0.2)
  Top 0.127: v67.88,45.89 67.88,43.64 69.75,43.64 U6.P65 | v51.12,51.02 51.38,51.27 51.38,56.64 52.38,57.64 52.38,58.52 52.12,58.77 49.75,58.77 49.75,59.77 50.5,60.52 51,60.52 U4.2
  Bottom 0.127: v67.88,45.89 67.12,46.64 62.5,46.64 62,47.14 58.5,47.14 55.38,50.27 51.88,50.27 v51.12,51.02
FLASH_MOSI  (via drill 0.2)
  Top 0.127: v67.38,47.52 67.38,43.14 69.75,43.14 U6.P64 | v57.88,50.77 57.75,50.89 57.75,58.02 U4.5
  Bottom 0.127: v67.38,47.52 67.25,47.64 59.25,47.64 59.12,47.52 58.62,47.52 57.88,48.27 v57.88,50.77
FLASH_SCLK  (via drill 0.2)
  Top 0.127: v68.62,50.64 68.62,46.14 69.75,46.14 U6.P70 | v61,56.64 58.38,59.27 57.88,59.27 U4.6
  Bottom 0.127: v68.62,50.64 67.38,51.89 63.38,51.89 61,54.27 v61,56.64
GET_CTRL_REG  (via drill 0.2)
  Top 0.127: v29.12,46.02 29.12,46.89 29,47.02 U3.66 | v44.12,30.52 v44.12,48.89 | v51.75,30.14 51.88,30.02 51.88,27.27 U6.P5
  Bottom 0.127: v29.12,46.02 30.88,47.77 33.12,47.77 34.25,48.89 v44.12,48.89 | v44.12,30.52 44.5,30.14 v51.75,30.14
GET_DATA_REG  (via drill 0.2)
  Top 0.127: v23.88,48.52 23.88,44.39 22.75,44.39 U3.78 | v42.75,50.77 43.12,50.39 43.12,45.27 43.38,45.02 43.38,34.14 42.62,33.39 v42.62,24.14 | v49.25,23.77 50.38,24.89 50.38,27.14 U6.P2
  Bottom 0.127: v23.88,48.52 24.88,49.52 34.62,49.52 34.75,49.39 36.62,49.39 38,50.77 v42.75,50.77 | v42.62,24.14 43,23.77 v49.25,23.77
GND  (via drill 0.2, 0.35)
  Top 0.3: J4.1 1,64.14 1,74.39 | 1,74.39 1,86.89 2,87.89 S1.1 | v6.62,59.39 6.62,57.77 7.12,57.27 JP4.2 | 25.88,63.64 26.88,63.64 27.12,63.39 27.12,60.89 27,60.77 27,60.14 28.25,58.89 28.25,56.39 28.75,55.89 C7.2 | 25.88,63.64 25.88,60.64 25.25,60.02 25.25,48.14 25,47.89 25,47.14 U3.74 | JP6.2 16.5,67.02 16.5,65.89 18.88,65.89 C8.1 18.88,66.02 18.88,66.77 19.75,67.64 19.75,70.89 C19.2 19.62,71.02 17.25,73.39 17.25,75.64 17,75.89 17,78.77 16,79.77 LED3.P1 16,79.89 16,80.89 LED3.P2 16,81.02 16,82.02 LED3.P3 16.12,82.02 19.38,82.02 19.38,83.77 22.88,87.27 28.38,87.27 28.38,85.02 X1.4 28.62,84.89 28.62,81.64 30.38,79.89 X1.5 | v24,65.39 25.75,63.64 25.88,63.64 | v1.75,74.39 1,74.39 | U1.12 69.88,64.27 69.88,65.39 U1.13 70,65.52 72.75,65.52 72.75,67.14 74.5,68.89 74.5,75.27 75.62,76.39 J2.8 | U1.2 60.38,68.02 59.12,68.02 59.12,69.64 59.62,70.14 62.12,70.14 62.12,77.02 61,78.14 61,79.77 X1.21 60.88,79.27 55.25,84.89 X1.18 | U2.22 34.25,75.27 34.38,75.39 34.38,76.64 37.5,79.77 38,79.77 X1.9 37.5,79.89 37.5,82.14 | 37.5,82.14 37.5,83.52 36.12,84.89 X1.8 | 52.94,70.2 52,71.14 51.25,71.14 U5.7 | 52.94,70.2 56.12,67.02 56.12,64.77 56.62,64.27 C24.2 | 52.94,70.2 53,70.27 53,79.52 53.25,79.77 X1.17 52.88,79.52 47.62,84.77 47.62,84.89 X1.14 47.5,84.89 45.75,83.14 45.75,82.14 | 40.62,60.52 40.62,62.14 U2.16 | 40.62,60.52 40.62,57.14 | 40.62,57.14 40.62,55.52 C10.2 | 45.75,82.14 45.75,79.89 X1.13 45.62,79.77 44.5,78.64 44.5,64.64 43.88,64.02 C9.1 43.75,63.89 43,63.14 43,62.77 v42.75,62.52 | v40.75,60.52 40.62,60.52 | 45.75,82.14 37.5,82.14 | J3.B1_A12 6.75,15.02 6.25,14.52 6.25,14.02 J3.SH2
  Top 0.3: v12.88,25.64 12.88,26.64 13,26.77 C6.2 | J3.A1_B12 6.75,21.64 6.25,22.14 J3.SH1 | v8.5,23.14 8.5,25.89 IC2.1 | 3.19,34.2 3.62,33.77 3.62,24.27 2.12,22.77 J3.SH3 | 3.19,34.2 2.38,35.02 MICRO_SD1.MP3 | MICRO_SD1.MP2 2.38,50.77 3.25,49.89 3.25,34.27 3.19,34.2 | MICRO_SD1.MP1 12,50.77 11.75,50.52 11.75,46.27 12.75,46.27 MICRO_SD1.6 12.88,46.14 13.62,46.14 13.62,45.64 13.75,45.52 13.75,45.39 14.25,44.89 v14.38,44.89 | 21.75,33.64 21.75,30.27 22.38,29.64 R30.1 | 21.75,33.64 22,33.89 22.62,33.89 U3.99 | v16.25,37.02 17.12,37.89 C2.2 | v12.5,37.27 12.12,36.89 12.12,35.89 MICRO_SD1.MP4 | v21.38,33.89 21.62,33.64 21.75,33.64 | 19.5,17.14 19.5,19.02 C12.1 | 19.5,17.14 19.5,16.52 C11.1 | R25.1 20.75,23.27 19.5,22.02 19.5,19.14 C12.1 | 27.75,15.02 27.75,17.89 29.25,19.39 29.25,20.64 30,21.39 C5.1 30,21.52 C23.1 30.12,25.14 30.38,25.39 30.38,28.52 29,29.89 29,31.52 U3.10 29,31.77 29,32.27 v28.5,32.77 | 27.75,15.02 27.75,13.14 28.25,12.64 C3.2 | 19.5,17.14 15.38,17.14 15.38,16.02 16.38,15.02 27.75,15.02 | v30.5,9.89 28.38,12.02 28.38,12.52 C3.2 | v15.12,23.77 19.38,19.52 C12.1 | R28.2 79.5,55.89 79.5,54.02 R27.2 79.5,53.77 79.5,51.89 R19.2 79.5,51.77 80,51.27 80,44.14 81.75,42.39 JP5.2 | v75.38,42.14 75.38,42.02 74.38,42.02 C4.1 74.25,41.89 74.25,36.02 v74,35.77 | v71.62,35.64 69.88,35.64 U6.P49 | v68.5,38.02 68.5,38.14 69.75,38.14 U6.P54 | U6.P68 69.88,45.14 71.25,45.14 v71.25,45.27 v71.25,48.39 | 65.69,50.58 65.75,50.64 67.5,50.64 67.5,49.52 U6.P73 | 65.69,50.58 65.5,50.39 65.5,49.52 U6.P77 | 58.12,51.52 58.12,51.39 58.5,51.02 58.5,49.52 U6.P91 | 58.12,51.52 58.12,53.77 59,53.77 59.38,53.39 59.88,53.39 C25.2